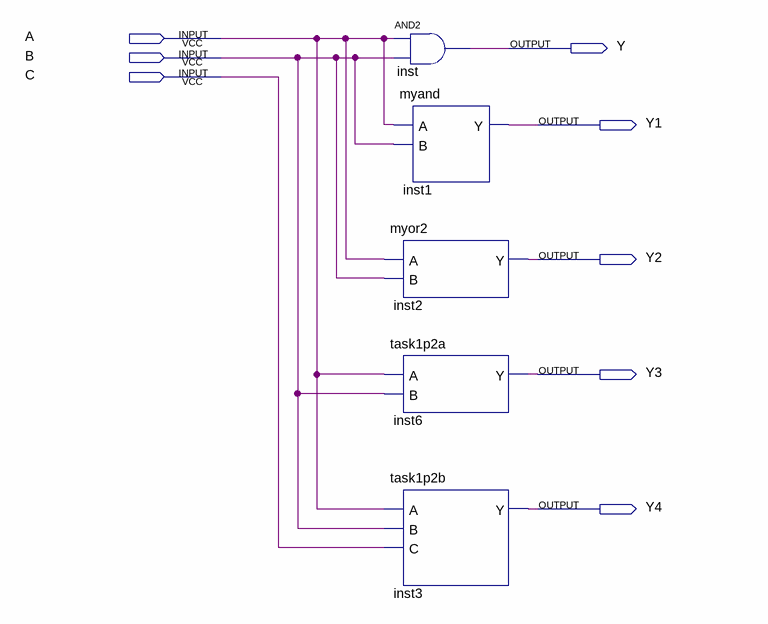
[diagram p0: schematic sheet]
// Quartus schematic myproject.bdf as structural Verilog: 5 symbols, 8 pins
module myproject (
  input  A,
  input  B,
  input  C,
  output Y,
  output Y1,
  output Y2,
  output Y3,
  output Y4
);

  and inst (Y, A, B);
  myand inst1 (.A(A), .B(B), .Y(Y1));
  myor2 inst2 (.A(A), .B(B), .Y(Y2));
  task1p2a inst6 (.A(A), .B(B), .Y(Y3));
  task1p2b inst3 (.A(A), .B(B), .C(C), .Y(Y4));
endmodule
